# EAGLE schematic STM32F446 front pane - v3 (EAGLE 9.6.2), part 2 of 2
## Sheet 6 of 8
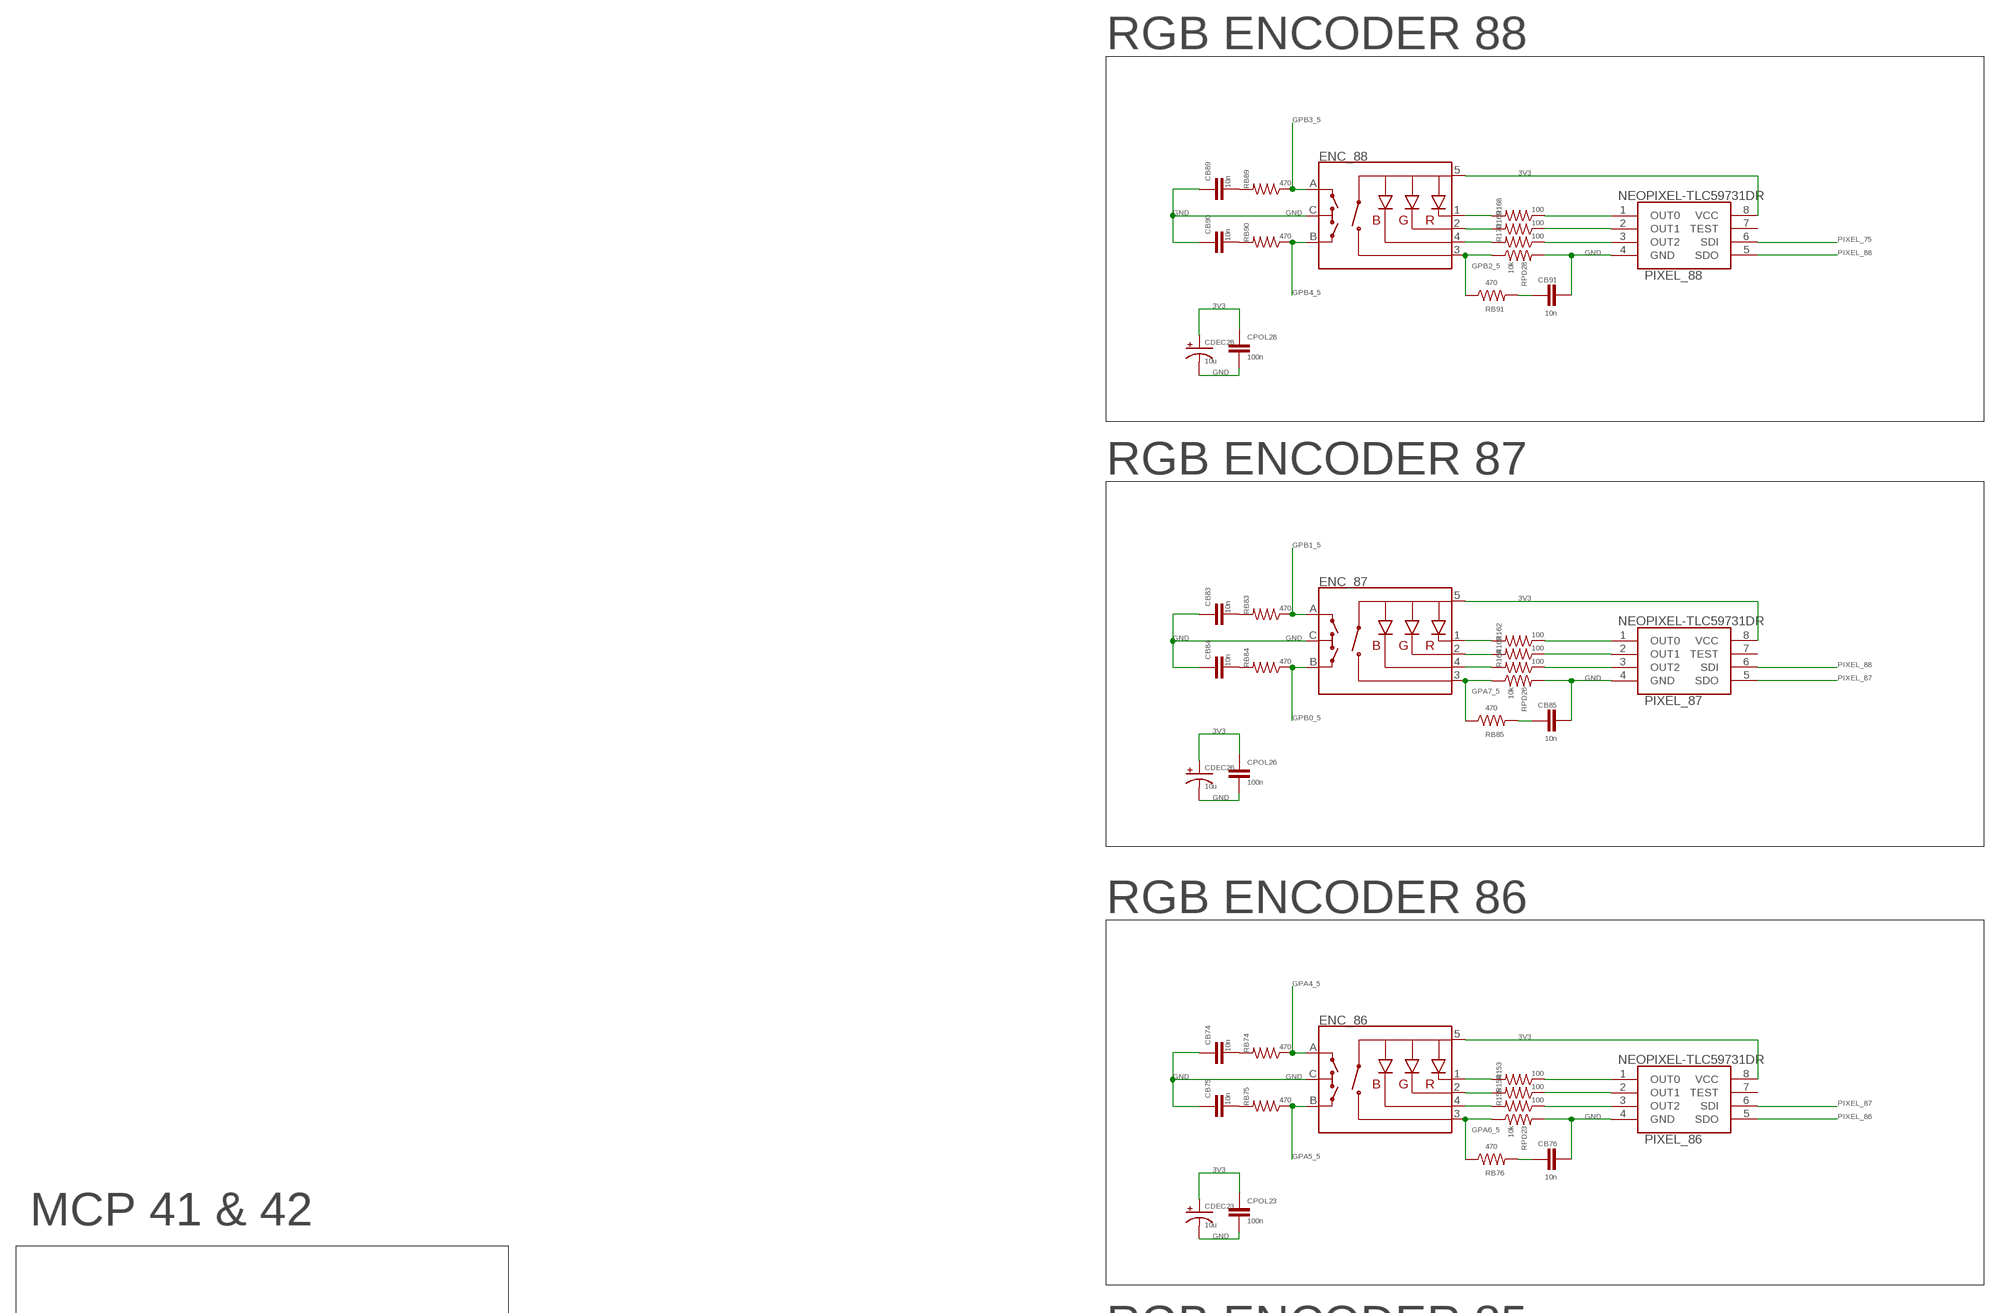
[diagram p12: schematic, sheet 6, part 1 of 2]
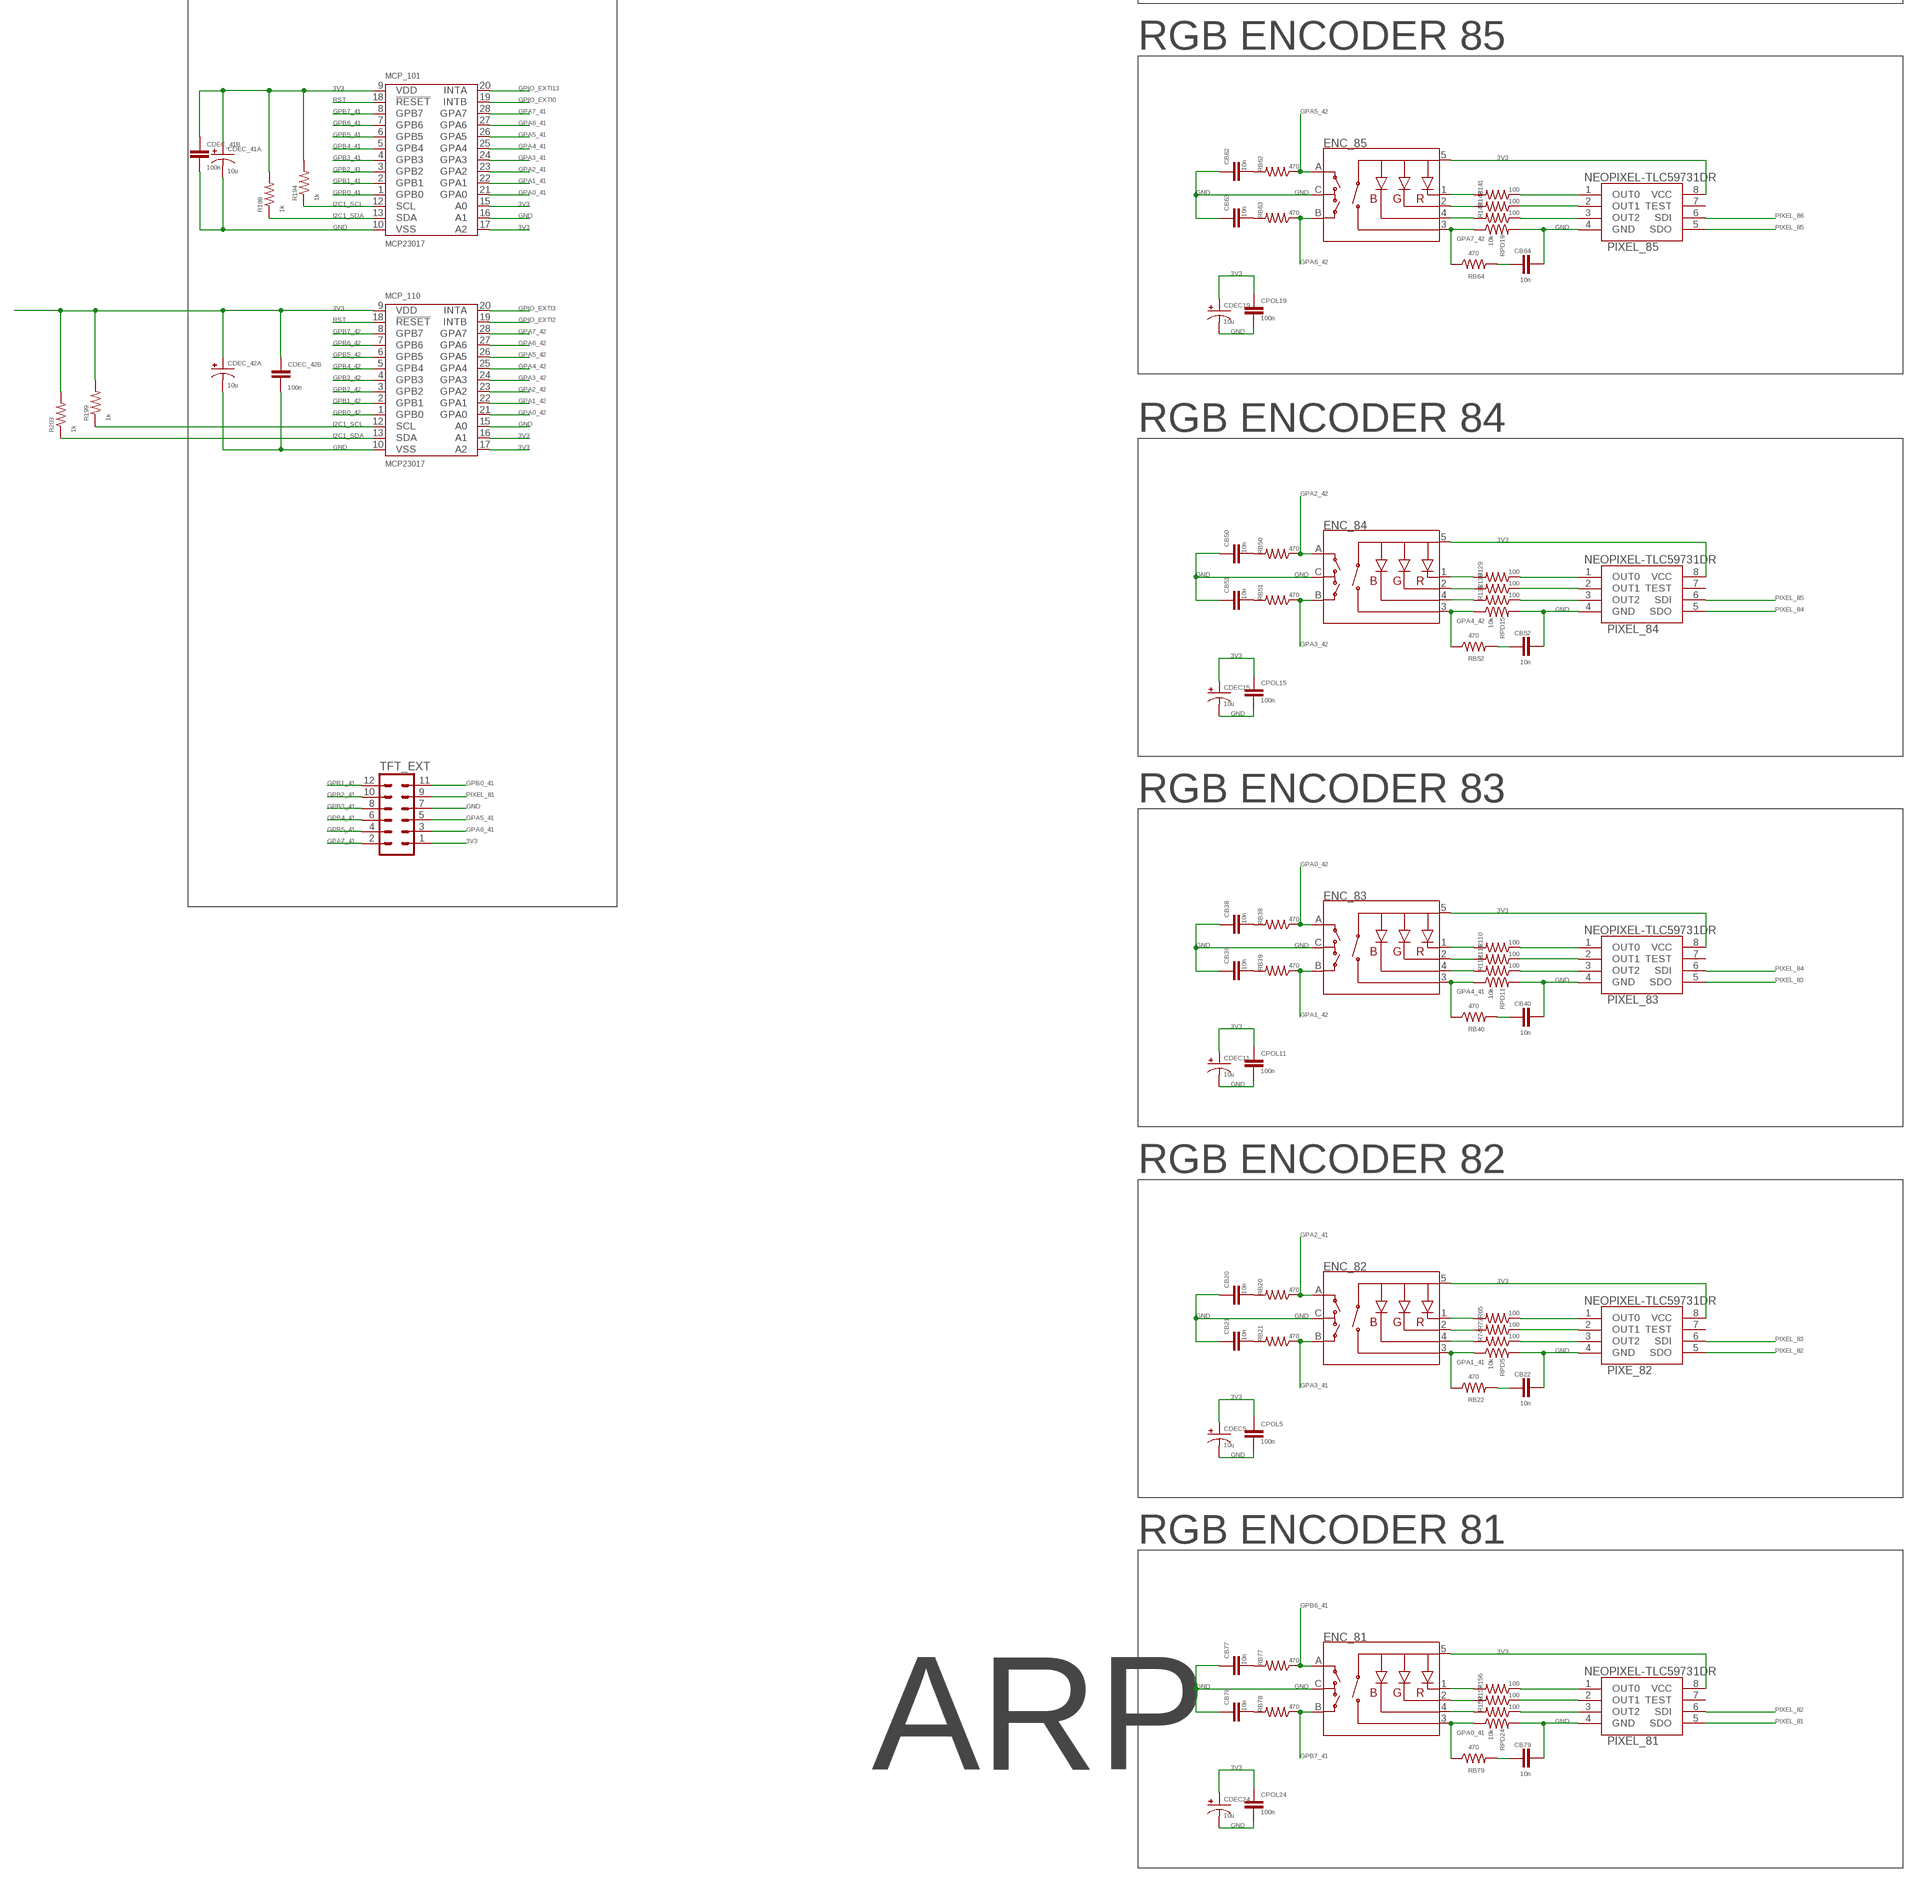
[diagram p13: schematic, sheet 6, part 2 of 2]

### Parts
CB20  10n  PASSIF-CAP-0805  [0805-CAP]
CB21  10n  PASSIF-CAP-0805  [0805-CAP]
CB22  10n  PASSIF-CAP-0805  [0805-CAP]
CB38  10n  PASSIF-CAP-0805  [0805-CAP]
CB39  10n  PASSIF-CAP-0805  [0805-CAP]
CB40  10n  PASSIF-CAP-0805  [0805-CAP]
CB50  10n  PASSIF-CAP-0805  [0805-CAP]
CB51  10n  PASSIF-CAP-0805  [0805-CAP]
CB52  10n  PASSIF-CAP-0805  [0805-CAP]
CB62  10n  PASSIF-CAP-0805  [0805-CAP]
CB63  10n  PASSIF-CAP-0805  [0805-CAP]
CB64  10n  PASSIF-CAP-0805  [0805-CAP]
CB74  10n  PASSIF-CAP-0805  [0805-CAP]
CB75  10n  PASSIF-CAP-0805  [0805-CAP]
CB76  10n  PASSIF-CAP-0805  [0805-CAP]
CB77  10n  PASSIF-CAP-0805  [0805-CAP]
CB78  10n  PASSIF-CAP-0805  [0805-CAP]
CB79  10n  PASSIF-CAP-0805  [0805-CAP]
CB83  10n  PASSIF-CAP-0805  [0805-CAP]
CB84  10n  PASSIF-CAP-0805  [0805-CAP]
CB85  10n  PASSIF-CAP-0805  [0805-CAP]
CB89  10n  PASSIF-CAP-0805  [0805-CAP]
CB90  10n  PASSIF-CAP-0805  [0805-CAP]
CB91  10n  PASSIF-CAP-0805  [0805-CAP]
CDEC5  10u  PASSIF-CPOL-US2917  [CPOL2917]
CDEC11  10u  PASSIF-CPOL-US2917  [CPOL2917]
CDEC15  10u  PASSIF-CPOL-US2917  [CPOL2917]
CDEC19  10u  PASSIF-CPOL-US2917  [CPOL2917]
CDEC23  10u  PASSIF-CPOL-US2917  [CPOL2917]
CDEC24  10u  PASSIF-CPOL-US2917  [CPOL2917]
CDEC26  10u  PASSIF-CPOL-US2917  [CPOL2917]
CDEC28  10u  PASSIF-CPOL-US2917  [CPOL2917]
CDEC_41A  10u  PASSIF-CPOL-US2917  [CPOL2917]
CDEC_41B  100n  PASSIF-CAP-0805  [0805-CAP]
CDEC_42A  10u  PASSIF-CPOL-US2917  [CPOL2917]
CDEC_42B  100n  PASSIF-CAP-0805  [0805-CAP]
CPOL5  100n  PASSIF-CAP-0805  [0805-CAP]
CPOL11  100n  PASSIF-CAP-0805  [0805-CAP]
CPOL15  100n  PASSIF-CAP-0805  [0805-CAP]
CPOL19  100n  PASSIF-CAP-0805  [0805-CAP]
CPOL23  100n  PASSIF-CAP-0805  [0805-CAP]
CPOL24  100n  PASSIF-CAP-0805  [0805-CAP]
CPOL26  100n  PASSIF-CAP-0805  [0805-CAP]
CPOL28  100n  PASSIF-CAP-0805  [0805-CAP]
ENC_81  ENCODER-RGB-SWITCH-NO_NUT  [ENCODER_LED_3]
ENC_82  ENCODER-RGB-SWITCH-NO_NUT  [ENCODER_LED_3]
ENC_83  ENCODER-RGB-SWITCH-NO_NUT  [ENCODER_LED_3]
ENC_84  ENCODER-RGB-SWITCH-NO_NUT  [ENCODER_LED_3]
ENC_85  ENCODER-RGB-SWITCH-NO_NUT  [ENCODER_LED_3]
ENC_86  ENCODER-RGB-SWITCH-NO_NUT  [ENCODER_LED_3]
ENC_87  ENCODER-RGB-SWITCH-NO_NUT  [ENCODER_LED_3]
ENC_88  ENCODER-RGB-SWITCH-NO_NUT  [ENCODER_LED_3]
MCP_101  MCP23017  [SOIC-28]
MCP_110  MCP23017  [SOIC-28]
PIXE_82  NEOPIXEL-TLC59731DR  [SOIC127P600X175-8N]
PIXEL_81  NEOPIXEL-TLC59731DR  [SOIC127P600X175-8N]
PIXEL_83  NEOPIXEL-TLC59731DR  [SOIC127P600X175-8N]
PIXEL_84  NEOPIXEL-TLC59731DR  [SOIC127P600X175-8N]
PIXEL_85  NEOPIXEL-TLC59731DR  [SOIC127P600X175-8N]
PIXEL_86  NEOPIXEL-TLC59731DR  [SOIC127P600X175-8N]
PIXEL_87  NEOPIXEL-TLC59731DR  [SOIC127P600X175-8N]
PIXEL_88  NEOPIXEL-TLC59731DR  [SOIC127P600X175-8N]
R65  100  PASSIF-RESISTOR-1206  [1206]
R73  100  PASSIF-RESISTOR-1206  [1206]
R74  100  PASSIF-RESISTOR-1206  [1206]
R110  100  PASSIF-RESISTOR-1206  [1206]
R111  100  PASSIF-RESISTOR-1206  [1206]
R112  100  PASSIF-RESISTOR-1206  [1206]
R129  100  PASSIF-RESISTOR-1206  [1206]
R130  100  PASSIF-RESISTOR-1206  [1206]
R131  100  PASSIF-RESISTOR-1206  [1206]
R141  100  PASSIF-RESISTOR-1206  [1206]
R142  100  PASSIF-RESISTOR-1206  [1206]
R143  100  PASSIF-RESISTOR-1206  [1206]
R153  100  PASSIF-RESISTOR-1206  [1206]
R154  100  PASSIF-RESISTOR-1206  [1206]
R155  100  PASSIF-RESISTOR-1206  [1206]
R156  100  PASSIF-RESISTOR-1206  [1206]
R157  100  PASSIF-RESISTOR-1206  [1206]
R158  100  PASSIF-RESISTOR-1206  [1206]
R162  100  PASSIF-RESISTOR-1206  [1206]
R163  100  PASSIF-RESISTOR-1206  [1206]
R164  100  PASSIF-RESISTOR-1206  [1206]
R168  100  PASSIF-RESISTOR-1206  [1206]
R169  100  PASSIF-RESISTOR-1206  [1206]
R170  100  PASSIF-RESISTOR-1206  [1206]
R194  1k  R-US_R0805  [R0805]
R198  1k  R-US_R0805  [R0805]
R199  1k  R-US_R0805  [R0805]
R203  1k  R-US_R0805  [R0805]
RB20  470  PASSIF-RESISTOR-1206  [1206]
RB21  470  PASSIF-RESISTOR-1206  [1206]
RB22  470  PASSIF-RESISTOR-1206  [1206]
RB38  470  PASSIF-RESISTOR-1206  [1206]
RB39  470  PASSIF-RESISTOR-1206  [1206]
RB40  470  PASSIF-RESISTOR-1206  [1206]
RB50  470  PASSIF-RESISTOR-1206  [1206]
RB51  470  PASSIF-RESISTOR-1206  [1206]
RB52  470  PASSIF-RESISTOR-1206  [1206]
RB62  470  PASSIF-RESISTOR-1206  [1206]
RB63  470  PASSIF-RESISTOR-1206  [1206]
RB64  470  PASSIF-RESISTOR-1206  [1206]
RB74  470  PASSIF-RESISTOR-1206  [1206]
RB75  470  PASSIF-RESISTOR-1206  [1206]
RB76  470  PASSIF-RESISTOR-1206  [1206]
RB77  470  PASSIF-RESISTOR-1206  [1206]
RB78  470  PASSIF-RESISTOR-1206  [1206]
RB79  470  PASSIF-RESISTOR-1206  [1206]
RB83  470  PASSIF-RESISTOR-1206  [1206]
RB84  470  PASSIF-RESISTOR-1206  [1206]
RB85  470  PASSIF-RESISTOR-1206  [1206]
RB89  470  PASSIF-RESISTOR-1206  [1206]
RB90  470  PASSIF-RESISTOR-1206  [1206]
RB91  470  PASSIF-RESISTOR-1206  [1206]
RPD5  10k  PASSIF-RESISTOR-1206  [1206]
RPD11  10k  PASSIF-RESISTOR-1206  [1206]
RPD15  10k  PASSIF-RESISTOR-1206  [1206]
RPD19  10k  PASSIF-RESISTOR-1206  [1206]
RPD23  10k  PASSIF-RESISTOR-1206  [1206]
RPD24  10k  PASSIF-RESISTOR-1206  [1206]
RPD26  10k  PASSIF-RESISTOR-1206  [1206]
RPD28  10k  PASSIF-RESISTOR-1206  [1206]
TFT_EXT  MA06-2  [MA06-2]

### Nets
3V3: CDEC5.+ CDEC11.+ CDEC15.+ CDEC19.+ CDEC23.+ CDEC24.+ CDEC26.+ CDEC28.+ CDEC_41A.+ CDEC_41B.1 CDEC_42A.+ CDEC_42B.1 CPOL5.1 CPOL11.1 CPOL15.1 CPOL19.1 CPOL23.1 CPOL24.1 CPOL26.1 CPOL28.1 ENC_81.5(+) ENC_82.5(+) ENC_83.5(+) ENC_84.5(+) ENC_85.5(+) ENC_86.5(+) ENC_87.5(+) ENC_88.5(+) MCP_101.9(VDD) MCP_101.15(A0) MCP_101.17(A2) MCP_110.9(VDD) MCP_110.16(A1) MCP_110.17(A2) PIXE_82.8(VCC) PIXEL_81.8(VCC) PIXEL_83.8(VCC) PIXEL_84.8(VCC) PIXEL_85.8(VCC) PIXEL_86.8(VCC) PIXEL_87.8(VCC) PIXEL_88.8(VCC) R194.2 R198.2 R199.2 R203.2 TFT_EXT.1 ; also sheet 1,2,3,4,5,7
GND: CB20.1 CB21.1 CB22.2 CB38.1 CB39.1 CB40.2 CB50.1 CB51.1 CB52.2 CB62.1 CB63.1 CB64.2 CB74.1 CB75.1 CB76.2 CB77.1 CB78.1 CB79.2 CB83.1 CB84.1 CB85.2 CB89.1 CB90.1 CB91.2 CDEC5.- CDEC11.- CDEC15.- CDEC19.- CDEC23.- CDEC24.- CDEC26.- CDEC28.- CDEC_41A.- CDEC_41B.2 CDEC_42A.- CDEC_42B.2 CPOL5.2 CPOL11.2 CPOL15.2 CPOL19.2 CPOL23.2 CPOL24.2 CPOL26.2 CPOL28.2 ENC_81.C ENC_82.C ENC_83.C ENC_84.C ENC_85.C ENC_86.C ENC_87.C ENC_88.C MCP_101.10(VSS) MCP_101.16(A1) MCP_110.10(VSS) MCP_110.15(A0) PIXE_82.4(GND) PIXEL_81.4(GND) PIXEL_83.4(GND) PIXEL_84.4(GND) PIXEL_85.4(GND) PIXEL_86.4(GND) PIXEL_87.4(GND) PIXEL_88.4(GND) RPD5.2 RPD11.2 RPD15.2 RPD19.2 RPD23.2 RPD24.2 RPD26.2 RPD28.2 TFT_EXT.7 ; also sheet 1,2,3,4,5,7
GPA0_41: ENC_81.3(SW) MCP_101.21(GPA0) RB79.1 RPD24.1
GPA0_42: ENC_83.A MCP_110.21(GPA0) RB38.1
GPA1_41: ENC_82.3(SW) MCP_101.22(GPA1) RB22.1 RPD5.1
GPA1_42: ENC_83.B MCP_110.22(GPA1) RB39.1
GPA2_41: ENC_82.A MCP_101.23(GPA2) RB20.1
GPA2_42: ENC_84.A MCP_110.23(GPA2) RB50.1
GPA3_41: ENC_82.B MCP_101.24(GPA3) RB21.1
GPA3_42: ENC_84.B MCP_110.24(GPA3) RB51.1
GPA4_5: ENC_86.A RB74.1 ; also sheet 5
GPA4_41: ENC_83.3(SW) MCP_101.25(GPA4) RB40.1 RPD11.1
GPA4_42: ENC_84.3(SW) MCP_110.25(GPA4) RB52.1 RPD15.1
GPA5_5: ENC_86.B RB75.1 ; also sheet 5
GPA5_41: MCP_101.26(GPA5) TFT_EXT.5
GPA5_42: ENC_85.A MCP_110.26(GPA5) RB62.1
GPA6_5: ENC_86.3(SW) RB76.1 RPD23.1 ; also sheet 5
GPA6_41: MCP_101.27(GPA6) TFT_EXT.3
GPA6_42: ENC_85.B MCP_110.27(GPA6) RB63.1
GPA7_5: ENC_87.3(SW) RB85.1 RPD26.1 ; also sheet 5
GPA7_41: MCP_101.28(GPA7) TFT_EXT.2
GPA7_42: ENC_85.3(SW) MCP_110.28(GPA7) RB64.1 RPD19.1
GPB0_5: ENC_87.B RB84.1 ; also sheet 5
GPB0_41: MCP_101.1(GPB0) TFT_EXT.11
GPB0_42: MCP_110.1(GPB0) ; also sheet 5
GPB1_5: ENC_87.A RB83.1 ; also sheet 5
GPB1_41: MCP_101.2(GPB1) TFT_EXT.12
GPB1_42: MCP_110.2(GPB1) ; also sheet 5
GPB2_5: ENC_88.3(SW) RB91.1 RPD28.1 ; also sheet 5
GPB2_41: MCP_101.3(GPB2) TFT_EXT.10
GPB2_42: MCP_110.3(GPB2) ; also sheet 5
GPB3_5: ENC_88.A RB89.1 ; also sheet 5
GPB3_41: MCP_101.4(GPB3) TFT_EXT.8
GPB3_42: MCP_110.4(GPB3) ; also sheet 5
GPB4_5: ENC_88.B RB90.1 ; also sheet 5
GPB4_41: MCP_101.5(GPB4) TFT_EXT.6
GPB4_42: MCP_110.5(GPB4) ; also sheet 5
GPB5_41: MCP_101.6(GPB5) TFT_EXT.4
GPB5_42: MCP_110.6(GPB5) ; also sheet 5
GPB6_41: ENC_81.A MCP_101.7(GPB6) RB77.1
GPB6_42: MCP_110.7(GPB6) ; also sheet 5
GPB7_41: ENC_81.B MCP_101.8(GPB7) RB78.1
GPB7_42: MCP_110.8(GPB7) ; also sheet 5
GPIO_EXTI0: MCP_101.19(INTB) ; also sheet 1
GPIO_EXTI2: MCP_110.19(INTB) ; also sheet 1
GPIO_EXTI3: MCP_110.20(INTA) ; also sheet 1
GPIO_EXTI13: MCP_101.20(INTA) ; also sheet 1
I2C1_SCL: MCP_101.12(SCL) MCP_110.12(SCL) R194.1 R199.1 ; also sheet 1,5
I2C1_SDA: MCP_101.13(SDA) MCP_110.13(SDA) R198.1 R203.1 ; also sheet 1,5
N$4510: ENC_82.1(-R) R65.2
N$4511: ENC_82.2(-G) R73.2
N$4512: ENC_82.4(-B) R74.2
N$4513: PIXE_82.1(OUT0) R65.1
N$4514: PIXE_82.2(OUT1) R73.1
N$4515: PIXE_82.3(OUT2) R74.1
N$4516: CB20.2 RB20.2
N$4517: CB21.2 RB21.2
N$4518: CB22.1 RB22.2
N$5782: ENC_83.1(-R) R110.2
N$5783: ENC_83.2(-G) R111.2
N$5784: ENC_83.4(-B) R112.2
N$5785: PIXEL_83.1(OUT0) R110.1
N$5786: PIXEL_83.2(OUT1) R111.1
N$5787: PIXEL_83.3(OUT2) R112.1
N$5788: CB38.2 RB38.2
N$5789: CB39.2 RB39.2
N$5790: CB40.1 RB40.2
N$6514: ENC_84.1(-R) R129.2
N$6515: ENC_84.2(-G) R130.2
N$6516: ENC_84.4(-B) R131.2
N$6517: PIXEL_84.1(OUT0) R129.1
N$6518: PIXEL_84.2(OUT1) R130.1
N$6519: PIXEL_84.3(OUT2) R131.1
N$6520: CB50.2 RB50.2
N$6521: CB51.2 RB51.2
N$6522: CB52.1 RB52.2
N$7246: ENC_85.1(-R) R141.2
N$7247: ENC_85.2(-G) R142.2
N$7248: ENC_85.4(-B) R143.2
N$7249: PIXEL_85.1(OUT0) R141.1
N$7250: PIXEL_85.2(OUT1) R142.1
N$7251: PIXEL_85.3(OUT2) R143.1
N$7252: CB62.2 RB62.2
N$7253: CB63.2 RB63.2
N$7254: CB64.1 RB64.2
N$7978: ENC_86.1(-R) R153.2
N$7979: ENC_86.2(-G) R154.2
N$7980: ENC_86.4(-B) R155.2
N$7981: PIXEL_86.1(OUT0) R153.1
N$7982: PIXEL_86.2(OUT1) R154.1
N$7983: PIXEL_86.3(OUT2) R155.1
N$7984: CB74.2 RB74.2
N$7985: CB75.2 RB75.2
N$7986: CB76.1 RB76.2
N$8161: ENC_81.1(-R) R156.2
N$8162: ENC_81.2(-G) R157.2
N$8163: ENC_81.4(-B) R158.2
N$8164: PIXEL_81.1(OUT0) R156.1
N$8165: PIXEL_81.2(OUT1) R157.1
N$8166: PIXEL_81.3(OUT2) R158.1
N$8167: CB77.2 RB77.2
N$8168: CB78.2 RB78.2
N$8169: CB79.1 RB79.2
N$8527: ENC_87.1(-R) R162.2
N$8528: ENC_87.2(-G) R163.2
N$8529: ENC_87.4(-B) R164.2
N$8530: PIXEL_87.1(OUT0) R162.1
N$8531: PIXEL_87.2(OUT1) R163.1
N$8532: PIXEL_87.3(OUT2) R164.1
N$8533: CB83.2 RB83.2
N$8534: CB84.2 RB84.2
N$8535: CB85.1 RB85.2
N$8893: ENC_88.1(-R) R168.2
N$8894: ENC_88.2(-G) R169.2
N$8895: ENC_88.4(-B) R170.2
N$8896: PIXEL_88.1(OUT0) R168.1
N$8897: PIXEL_88.2(OUT1) R169.1
N$8898: PIXEL_88.3(OUT2) R170.1
N$8899: CB89.2 RB89.2
N$8900: CB90.2 RB90.2
N$8901: CB91.1 RB91.2
PIXEL_75: PIXEL_88.6(SDI) ; also sheet 5
PIXEL_81: PIXEL_81.5(SDO) TFT_EXT.9
PIXEL_82: PIXE_82.5(SDO) PIXEL_81.6(SDI)
PIXEL_83: PIXE_82.6(SDI) PIXEL_83.5(SDO)
PIXEL_84: PIXEL_83.6(SDI) PIXEL_84.5(SDO)
PIXEL_85: PIXEL_84.6(SDI) PIXEL_85.5(SDO)
PIXEL_86: PIXEL_85.6(SDI) PIXEL_86.5(SDO)
PIXEL_87: PIXEL_86.6(SDI) PIXEL_87.5(SDO)
PIXEL_88: PIXEL_87.6(SDI) PIXEL_88.5(SDO)
RST: MCP_101.18(!RESET) MCP_110.18(!RESET) ; also sheet 1,2,3,4,5
Unconnected: PIXE_82.7(TEST) PIXEL_81.7(TEST) PIXEL_83.7(TEST) PIXEL_84.7(TEST) PIXEL_85.7(TEST) PIXEL_86.7(TEST) PIXEL_87.7(TEST) PIXEL_88.7(TEST)

### Notes on the sheet
- RGB ENCODER 88
- RGB ENCODER 87
- RGB ENCODER 86
- MCP 41 & 42
- RGB ENCODER 85
- RGB ENCODER 84
- RGB ENCODER 83
- RGB ENCODER 82
- RGB ENCODER 81
- ARP

## Sheet 7 of 8
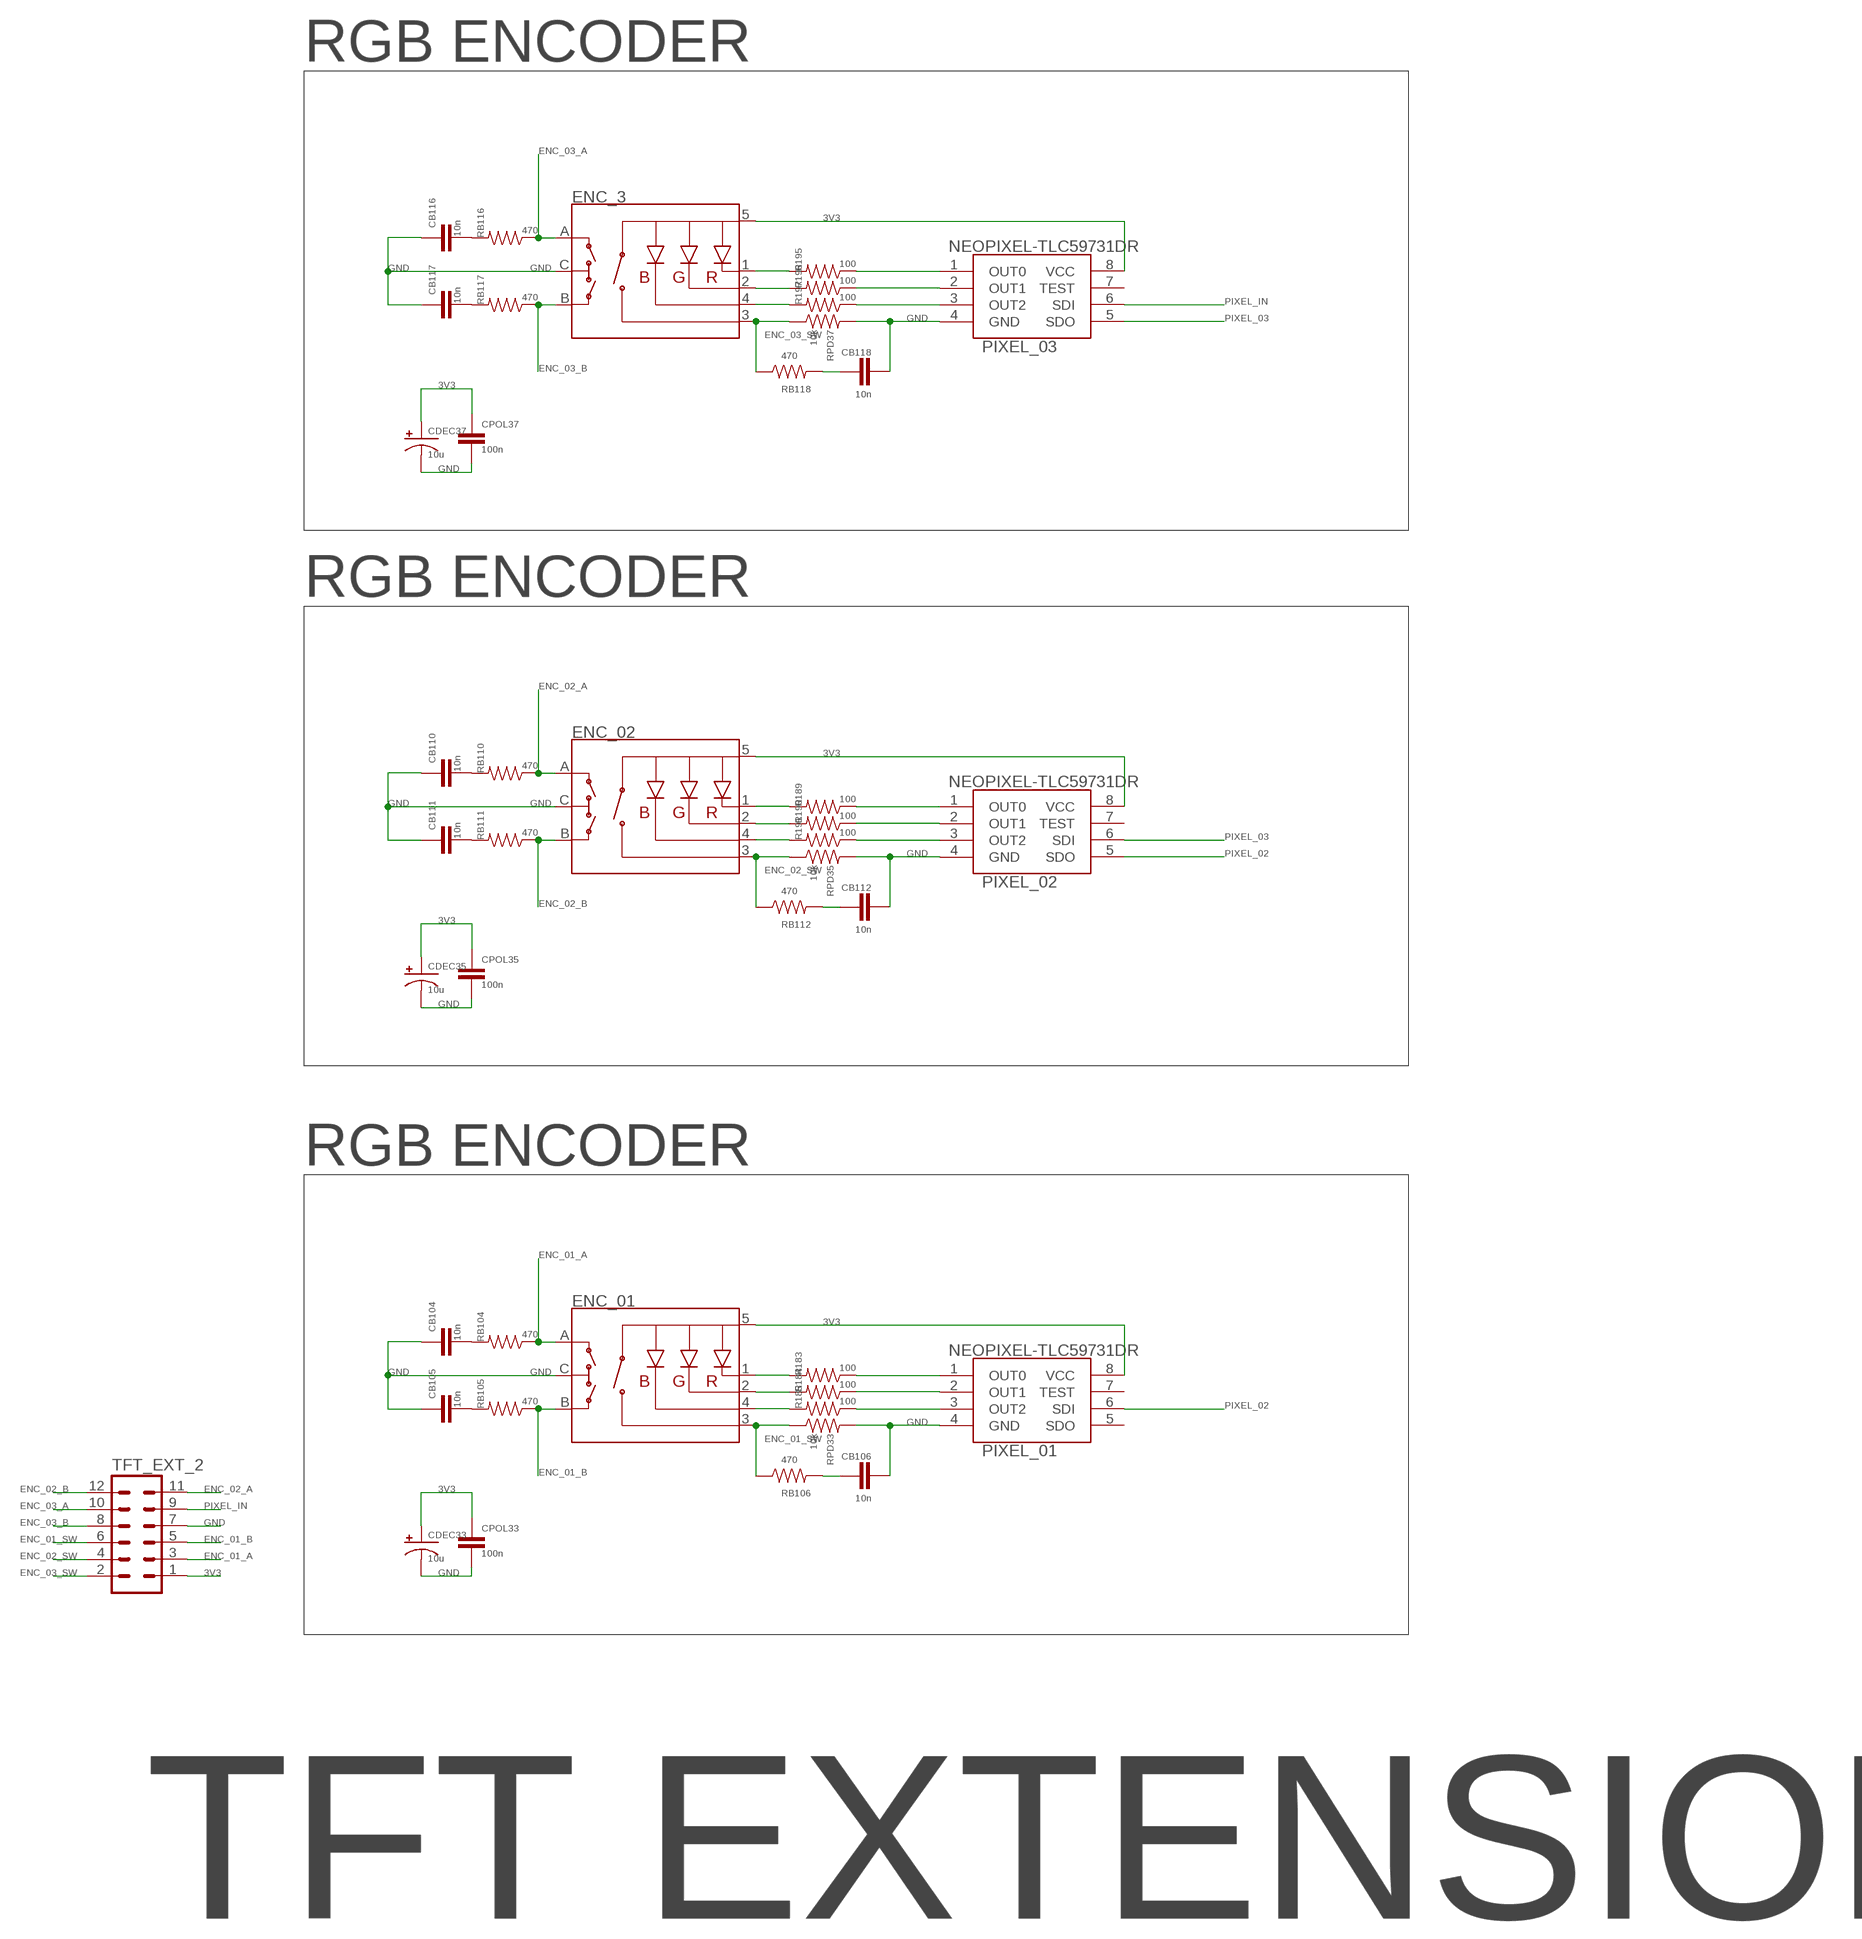
[diagram p14: schematic, sheet 7]

### Parts
CB104  10n  PASSIF-CAP-0805  [0805-CAP]
CB105  10n  PASSIF-CAP-0805  [0805-CAP]
CB106  10n  PASSIF-CAP-0805  [0805-CAP]
CB110  10n  PASSIF-CAP-0805  [0805-CAP]
CB111  10n  PASSIF-CAP-0805  [0805-CAP]
CB112  10n  PASSIF-CAP-0805  [0805-CAP]
CB116  10n  PASSIF-CAP-0805  [0805-CAP]
CB117  10n  PASSIF-CAP-0805  [0805-CAP]
CB118  10n  PASSIF-CAP-0805  [0805-CAP]
CDEC33  10u  PASSIF-CPOL-US2917  [CPOL2917]
CDEC35  10u  PASSIF-CPOL-US2917  [CPOL2917]
CDEC37  10u  PASSIF-CPOL-US2917  [CPOL2917]
CPOL33  100n  PASSIF-CAP-0805  [0805-CAP]
CPOL35  100n  PASSIF-CAP-0805  [0805-CAP]
CPOL37  100n  PASSIF-CAP-0805  [0805-CAP]
ENC_01  ENCODER-RGB-SWITCH-NO_NUT  [ENCODER_LED_3]
ENC_02  ENCODER-RGB-SWITCH-NO_NUT  [ENCODER_LED_3]
ENC_3  ENCODER-RGB-SWITCH-NO_NUT  [ENCODER_LED_3]
PIXEL_01  NEOPIXEL-TLC59731DR  [SOIC127P600X175-8N]
PIXEL_02  NEOPIXEL-TLC59731DR  [SOIC127P600X175-8N]
PIXEL_03  NEOPIXEL-TLC59731DR  [SOIC127P600X175-8N]
R183  100  PASSIF-RESISTOR-1206  [1206]
R184  100  PASSIF-RESISTOR-1206  [1206]
R185  100  PASSIF-RESISTOR-1206  [1206]
R189  100  PASSIF-RESISTOR-1206  [1206]
R190  100  PASSIF-RESISTOR-1206  [1206]
R191  100  PASSIF-RESISTOR-1206  [1206]
R195  100  PASSIF-RESISTOR-1206  [1206]
R196  100  PASSIF-RESISTOR-1206  [1206]
R197  100  PASSIF-RESISTOR-1206  [1206]
RB104  470  PASSIF-RESISTOR-1206  [1206]
RB105  470  PASSIF-RESISTOR-1206  [1206]
RB106  470  PASSIF-RESISTOR-1206  [1206]
RB110  470  PASSIF-RESISTOR-1206  [1206]
RB111  470  PASSIF-RESISTOR-1206  [1206]
RB112  470  PASSIF-RESISTOR-1206  [1206]
RB116  470  PASSIF-RESISTOR-1206  [1206]
RB117  470  PASSIF-RESISTOR-1206  [1206]
RB118  470  PASSIF-RESISTOR-1206  [1206]
RPD33  10k  PASSIF-RESISTOR-1206  [1206]
RPD35  10k  PASSIF-RESISTOR-1206  [1206]
RPD37  10k  PASSIF-RESISTOR-1206  [1206]
TFT_EXT_2  MA06-2  [MA06-2]

### Nets
3V3: CDEC33.+ CDEC35.+ CDEC37.+ CPOL33.1 CPOL35.1 CPOL37.1 ENC_01.5(+) ENC_02.5(+) ENC_3.5(+) PIXEL_01.8(VCC) PIXEL_02.8(VCC) PIXEL_03.8(VCC) TFT_EXT_2.1 ; also sheet 1,2,3,4,5,6
ENC_01_A: ENC_01.A RB104.1 TFT_EXT_2.3
ENC_01_B: ENC_01.B RB105.1 TFT_EXT_2.5
ENC_01_SW: ENC_01.3(SW) RB106.1 RPD33.1 TFT_EXT_2.6
ENC_02_A: ENC_02.A RB110.1 TFT_EXT_2.11
ENC_02_B: ENC_02.B RB111.1 TFT_EXT_2.12
ENC_02_SW: ENC_02.3(SW) RB112.1 RPD35.1 TFT_EXT_2.4
ENC_03_A: ENC_3.A RB116.1 TFT_EXT_2.10
ENC_03_B: ENC_3.B RB117.1 TFT_EXT_2.8
ENC_03_SW: ENC_3.3(SW) RB118.1 RPD37.1 TFT_EXT_2.2
GND: CB104.1 CB105.1 CB106.2 CB110.1 CB111.1 CB112.2 CB116.1 CB117.1 CB118.2 CDEC33.- CDEC35.- CDEC37.- CPOL33.2 CPOL35.2 CPOL37.2 ENC_01.C ENC_02.C ENC_3.C PIXEL_01.4(GND) PIXEL_02.4(GND) PIXEL_03.4(GND) RPD33.2 RPD35.2 RPD37.2 TFT_EXT_2.7 ; also sheet 1,2,3,4,5,6
N$9808: ENC_01.1(-R) R183.2
N$9809: ENC_01.2(-G) R184.2
N$9810: ENC_01.4(-B) R185.2
N$9811: PIXEL_01.1(OUT0) R183.1
N$9812: PIXEL_01.2(OUT1) R184.1
N$9813: PIXEL_01.3(OUT2) R185.1
N$9814: CB104.2 RB104.2
N$9815: CB105.2 RB105.2
N$9816: CB106.1 RB106.2
N$10174: ENC_02.1(-R) R189.2
N$10175: ENC_02.2(-G) R190.2
N$10176: ENC_02.4(-B) R191.2
N$10177: PIXEL_02.1(OUT0) R189.1
N$10178: PIXEL_02.2(OUT1) R190.1
N$10179: PIXEL_02.3(OUT2) R191.1
N$10180: CB110.2 RB110.2
N$10181: CB111.2 RB111.2
N$10182: CB112.1 RB112.2
N$10540: ENC_3.1(-R) R195.2
N$10541: ENC_3.2(-G) R196.2
N$10542: ENC_3.4(-B) R197.2
N$10543: PIXEL_03.1(OUT0) R195.1
N$10544: PIXEL_03.2(OUT1) R196.1
N$10545: PIXEL_03.3(OUT2) R197.1
N$10546: CB116.2 RB116.2
N$10547: CB117.2 RB117.2
N$10548: CB118.1 RB118.2
PIXEL_02: PIXEL_01.6(SDI) PIXEL_02.5(SDO)
PIXEL_03: PIXEL_02.6(SDI) PIXEL_03.5(SDO)
PIXEL_IN: PIXEL_03.6(SDI) TFT_EXT_2.9
Unconnected: PIXEL_01.5(SDO) PIXEL_01.7(TEST) PIXEL_02.7(TEST) PIXEL_03.7(TEST)

### Notes on the sheet
- RGB ENCODER
- RGB ENCODER
- RGB ENCODER
- TFT EXTENSION

## Sheet 8 of 8

## Library data of the parts
0V/5V = stock-perso:PINHEADER-M04: Headers & Wire Housing, 1 Row, 4 Position
ANALOG_IN = con-lstb:MA04-1: PIN HEADER; OC_FARNELL: unknown; OC_NEWARK: unknown
C4-C12 C16-C18 C22-C24 C28-C30 C34-C36 C40-C42 C46-C48 CB1-CB6 CB8-CB45 CB47-CB68 CB70-CB85 CB89-CB94 CB98-CB100 CB104-CB106 CB110-CB112 CB116-CB118 CDEC13 CDEC21 CDEC30 CDEC32 CDEC36 CDEC39 CDEC_1 CDEC_2 CDEC_2B1-CDEC_2B3 CDEC_3-CDEC_5 CDEC_5B CDEC_6-CDEC_11 CDEC_11B CDEC_12 CDEC_12B CDEC_13 CDEC_41B CDEC_42B CPOL1-CPOL12 CPOL14-CPOL20 CPOL22-CPOL26 CPOL28 CPOL29 CPOL31 CPOL33 CPOL35 CPOL37 = stock-perso:PASSIF-CAP
C55 C60 C66-C71 = MyComponents:C-US: SMD Multilayer Ceramic Capacitor; MOUSER: 80-C0805C104J5RAUTO
C62 C65 = MyComponents:CPOL-US: SMT Tantalum Capacitor; MOUSER: 581-TPSE477K010R0200
C76 = rcl:C-EU: CAPACITOR, European symbol; SPICEPREFIX: C
CDEC1-CDEC12 CDEC14-CDEC20 CDEC22-CDEC26 CDEC28 CDEC29 CDEC31 CDEC33 CDEC35 CDEC37 CDEC_2A1-CDEC_2A3 CDEC_5A CDEC_11A CDEC_12A CDEC_41A CDEC_42A CPOL13 CPOL21 CPOL30 CPOL32 CPOL36 CPOL39 = stock-perso:PASSIF-CPOL-US: SMT Tantalum Capacitor; MOUSER: 581-TPSE477K010R0200
CONN_STH_BRD_1 CONN_STH_BRD_2 = MyComponents:MA10-2: Headers & Wire Housing, 2 Row, 20 Position; OC_FARNELL: unknown; OC_NEWARK: unknown
ENC_01 ENC_02 ENC_3 ENC_11 ENC_13 ENC_14 ENC_21 ENC_23 ENC_41 ENC_44 ENC_45 ENC_48 ENC_51 ENC_53-ENC_57 ENC_61-ENC_64 ENC_71-ENC_75 ENC_81-ENC_88 S24 S31 S34 S35 = stock-perso:ENCODER-RGB-SWITCH: Illuminated Rotary Encoder w/ RGB LED and select switch Encoders rotate similarly to potentiometers, but they’re different from potentiometers in that an encoder has full rotation without limits. They output gray code so that you can tell how much and in which direction the encoder has been turned. This encoder includes an RGB LED and a push-down select switch. Part #: Top Up EC12PLRGBSDVBF-D <http://top-up.so-buy.com/front/bin/ptdetail.phtml?Part=EC12PLRGBSDVBF-D> SparkFun Products Rotary Encoder - Illuminated (RGB) <https://www.sparkfun.com/products/10982> (COM-10982); PROD_ID: RES-14168
F446 = STM32F446RCT7:STM32F446RCT7: 32 Bit Microcontroller, High Performance, ARM Cortex-M4, 180 MHz, 256 KB, 128 KB, 64, LQFP; AVAILABILITY: Unavailable; DESCRIPTION: ARM® Cortex®-M4 STM32F4 Microcontroller IC 32-Bit 180MHz 256KB (256K x 8) FLASH 64-LQFP (10x10); DIGIKEY-PURCHASE-URL: https://snapeda.com/shop?store=DigiKey&id=703054; MF: STMicroelectronics; MP: STM32F446RCT7; PACKAGE: LQFP-64 STMicroelectronics; PRICE: None
GREEN LED_3V3 LED_5V = Passives:LED
L1 = MyComponents:L-US: SMD Ferrite Bead; MOUSER: 963-CKP2012N1R0M-T
LED1 LED2 LED4 LED6 LED7 LED22 LED_42 LED_43 LED_46 LED_47 = OPL_Optoelectronics:DIP-LED-RGB-COMMON-ANODE(4P-D8MM): 304090065; MPN: CZXR-80RGB03-A
MCP_000 MCP_001 MCP_010 MCP_011 MCP_100 MCP_101 MCP_110 MCP_111 = a_ranger_work:MCP23017
PIXE_82 PIXEL_01-PIXEL_03 PIXEL_11-PIXEL_14 PIXEL_21-PIXEL_24 PIXEL_31-PIXEL_35 PIXEL_41-PIXEL_48 PIXEL_51-PIXEL_57 PIXEL_61-PIXEL_65 PIXEL_71-PIXEL_75 PIXEL_81 PIXEL_83-PIXEL_88 = stock-perso:NEOPIXEL-TLC59731DR: 3-Channel, 8-Bit, PWM LED Driver with Single-Wire Interface (similaire à du neopixel) Source: Datasheet <http://www.ti.com/lit/gpn/tlc59731>; ARROW_PART_NUMBER: TLC59731DR; ARROW_PRICE-STOCK: https://www.arrow.com/en/products/tlc59731dr/texas-instruments; DESCRIPTION: 3-Channel, 8-Bit, PWM LED Driver with Single-Wire Interface; HEIGHT: 1.75mm; MANUFACTURER_NAME: Texas Instruments; MANUFACTURER_PART_NUMBER: TLC59731DR; MOUSER_PART_NUMBER: 595-TLC59731DR; MOUSER_PRICE-STOCK: https://www.mouser.co.uk/ProductDetail/Texas-Instruments/TLC59731DR?qs=s44pgLhgXQgiW%2FpyLmUsDA%3D%3D
R1 R2 R4 R5 R149 R165 R166 R182 R186 R187 R194 R198 R199 R203-R205 = 6P1_EVB:R-US_: RESISTOR, American symbol
R3 R6-R78 R80 R82-R86 R88 R89 R91 R93 R94 R96-R148 R150-R164 R167-R181 R183-R185 R188-R193 R195-R197 R200-R202 RB1-RB6 RB8-RB45 RB47-RB68 RB70-RB85 RB89-RB94 RB98-RB100 RB104-RB106 RB110-RB112 RB116-RB118 RPD1-RPD12 RPD14-RPD20 RPD22-RPD26 RPD28 RPD29 RPD31 RPD33 RPD35 RPD37 = stock-perso:PASSIF-RESISTOR
R79 R81 R87 R90 R92 R95 = MyComponents:R-US: SMD Resistor; MOUSER: 660-RK73H2ATTDD1R00F
S2 = stock-perso:SWITCH-SKRKAEE020: Tactile Switches 3.9x2.9x2.0mm 160gf Packaging Temp 80oC Source: Datasheet <http://www.alps.com/prod/info/J/HTML/Tact/SurfaceMount/SKRK/SKRKAEE020.html>; DESCRIPTION: Tactile Switches 3.9x2.9x2.0mm 160gf Packaging Temp 80oC; HEIGHT: 2mm; MANUFACTURER_NAME: ALPS; MANUFACTURER_PART_NUMBER: SKRKAEE020; MOUSER_PART_NUMBER: 688-SKRKAEE020; MOUSER_PRICE-STOCK: https://www.mouser.co.uk/ProductDetail/ALPS/SKRKAEE020?qs=MrosSN5%252BUQW89XjXIp8Ugw%3D%3D
S32 S33 S_12 S_22 SW_42 SW_43 SW_46 SW_47 SW_52 SW_65 = Switch:B3F-1000: Tactile Switch SPST-NO Top Actuated Through Hole Manufacturer's datasheet <https://omronfs.omron.com/en_US/ecb/products/pdf/en-b3f.pdf>; CREATED_BY: PCBLayout.com; DIGI_KEY_PART_NUMBER: SW400-ND; MANUFACTURER: Omron Electronics Inc-EMC Div; MPN: B3F-1000; PACKAGE: SPST-NO
STLINK = MyComponents:MA03-2: Headers & Wire Housing, 2 Row, 6 Position; MOUSER: 649-75867-331LF
TFT_EXT TFT_EXT_2 = con-lstb:MA06-2: PIN HEADER; OC_FARNELL: unknown; OC_NEWARK: unknown
TLV75533 = TLV75533PDBVR:TLV75533PDBVR: 500mA Low-IQ Small-Size Low-Dropout (LDO) Regulator 5-SOT-23 -40 to 125; AVAILABILITY: Unavailable; DESCRIPTION: Linear Voltage Regulator IC 1 Output 500mA SOT-23-5; MF: Texas Instruments; MP: TLV75533PDBVR; PACKAGE: SOT-23 Texas Instruments; PRICE: None
UART_ANALOG UART_DISCO UART_MIDI = con-lstb:MA03-1: PIN HEADER; OC_FARNELL: unknown; OC_NEWARK: unknown